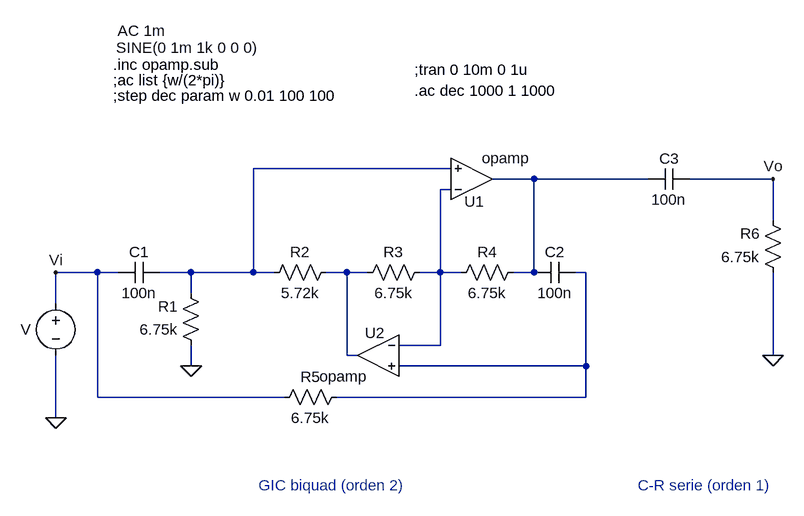
[diagram p0: schematic TS6.asc]
TS6.asc, the LTspice schematic file:
Version 4
SHEET 1 1088 792
WIRE 224 288 -80 288
WIRE 352 304 288 304
WIRE 528 304 352 304
WIRE 720 304 592 304
WIRE 224 320 208 320
WIRE 720 368 720 304
WIRE -320 448 -384 448
WIRE -288 448 -320 448
WIRE -176 448 -224 448
WIRE -80 448 -80 288
WIRE -80 448 -176 448
WIRE -48 448 -80 448
WIRE 64 448 32 448
WIRE 96 448 64 448
WIRE 208 448 208 320
WIRE 208 448 176 448
WIRE 240 448 208 448
WIRE 352 448 352 304
WIRE 352 448 320 448
WIRE 432 448 416 448
WIRE -176 480 -176 448
WIRE -384 496 -384 448
WIRE 208 560 208 448
WIRE 208 560 144 560
WIRE 64 576 64 448
WIRE 80 576 64 576
WIRE 720 576 720 448
WIRE -176 592 -176 560
WIRE 432 592 432 448
WIRE 432 592 144 592
WIRE -320 640 -320 448
WIRE -32 640 -320 640
WIRE 432 640 432 592
WIRE 432 640 48 640
WIRE -384 672 -384 576
FLAG -384 448 Vi
FLAG 720 304 Vo
FLAG -384 672 0
FLAG -176 592 0
FLAG 720 576 0
SYMBOL voltage -384 480 R0
WINDOW 123 95 -404 Left 2
WINDOW 39 0 0 Left 2
WINDOW 0 -54 56 Left 2
WINDOW 3 93 -378 Left 2
SYMATTR Value2 AC 1m
SYMATTR InstName V
SYMATTR Value SINE(0 1m 1k 0 0 0)
SYMBOL res -160 576 R180
WINDOW 0 36 76 Left 2
WINDOW 3 36 40 Left 2
SYMATTR InstName R1
SYMATTR Value 6.75k
SYMBOL cap -288 464 R270
WINDOW 0 32 32 VTop 2
WINDOW 3 0 32 VBottom 2
SYMATTR InstName C1
SYMATTR Value 100n
SYMBOL Opamps\\opamp 256 368 M180
WINDOW 0 20 29 Right 2
SYMATTR InstName U1
SYMBOL cap 352 464 R270
WINDOW 0 32 32 VTop 2
WINDOW 3 0 32 VBottom 2
SYMATTR InstName C2
SYMATTR Value 100n
SYMBOL res 48 432 R90
WINDOW 0 0 56 VBottom 2
WINDOW 3 32 56 VTop 2
SYMATTR InstName R2
SYMATTR Value 5.72k
SYMBOL res 192 432 R90
WINDOW 0 0 56 VBottom 2
WINDOW 3 32 56 VTop 2
SYMATTR InstName R3
SYMATTR Value 6.75k
SYMBOL Opamps\\opamp 112 512 M0
WINDOW 0 20 29 Right 2
SYMATTR InstName U2
SYMBOL res 336 432 R90
WINDOW 0 0 56 VBottom 2
WINDOW 3 32 56 VTop 2
SYMATTR InstName R4
SYMATTR Value 6.75k
SYMBOL res 64 624 R90
WINDOW 0 0 56 VBottom 2
WINDOW 3 32 56 VTop 2
SYMATTR InstName R5
SYMATTR Value 6.75k
SYMBOL cap 528 320 R270
WINDOW 0 32 32 VTop 2
WINDOW 3 0 32 VBottom 2
SYMATTR InstName C3
SYMATTR Value 100n
SYMBOL res 736 464 R180
WINDOW 0 36 76 Left 2
WINDOW 3 36 40 Left 2
SYMATTR InstName R6
SYMATTR Value 6.75k
TEXT 168 136 Left 2 !;tran 0 10m 0 1u
TEXT 168 168 Left 2 !.ac dec 1000 1 1000
TEXT -296 176 Left 2 !;step dec param w 0.01 100 100
TEXT -296 152 Left 2 !;ac list {w/(2*pi)}
TEXT -296 128 Left 2 !.inc opamp.sub
TEXT 512 776 Left 2 ;C-R serie (orden 1)
TEXT -72 776 Left 2 ;GIC biquad (orden 2)

The netlist it stands for:
* TS6.asc
V Vi 0 SINE(0 1m 1k 0 0 0) AC 1m
R1 0 N001 6.75k
C1 Vi N001 100n
XU1 N003 N001 N002 opamp Aol=100K GBW=10Meg  ; pins invin noninvin out
C2 N002 N005 100n
R2 N004 N001 5.72k
R3 N003 N004 6.75k
XU2 N003 N005 N004 opamp Aol=100K GBW=10Meg  ; pins invin noninvin out
R4 N002 N003 6.75k
R5 N005 Vi 6.75k
C3 N002 Vo 100n
R6 0 Vo 6.75k
;tran 0 10m 0 1u
.ac dec 1000 1 1000
;step dec param w 0.01 100 100
;ac list {w/(2*pi)}
.inc opamp.sub
* C-R serie (orden 1)
* GIC biquad (orden 2)
.backanno
.end